# Altium schematic sheet posture_corrector_schematic.SchDoc
size A4; SheetNumber: 1; SheetTotal: 1
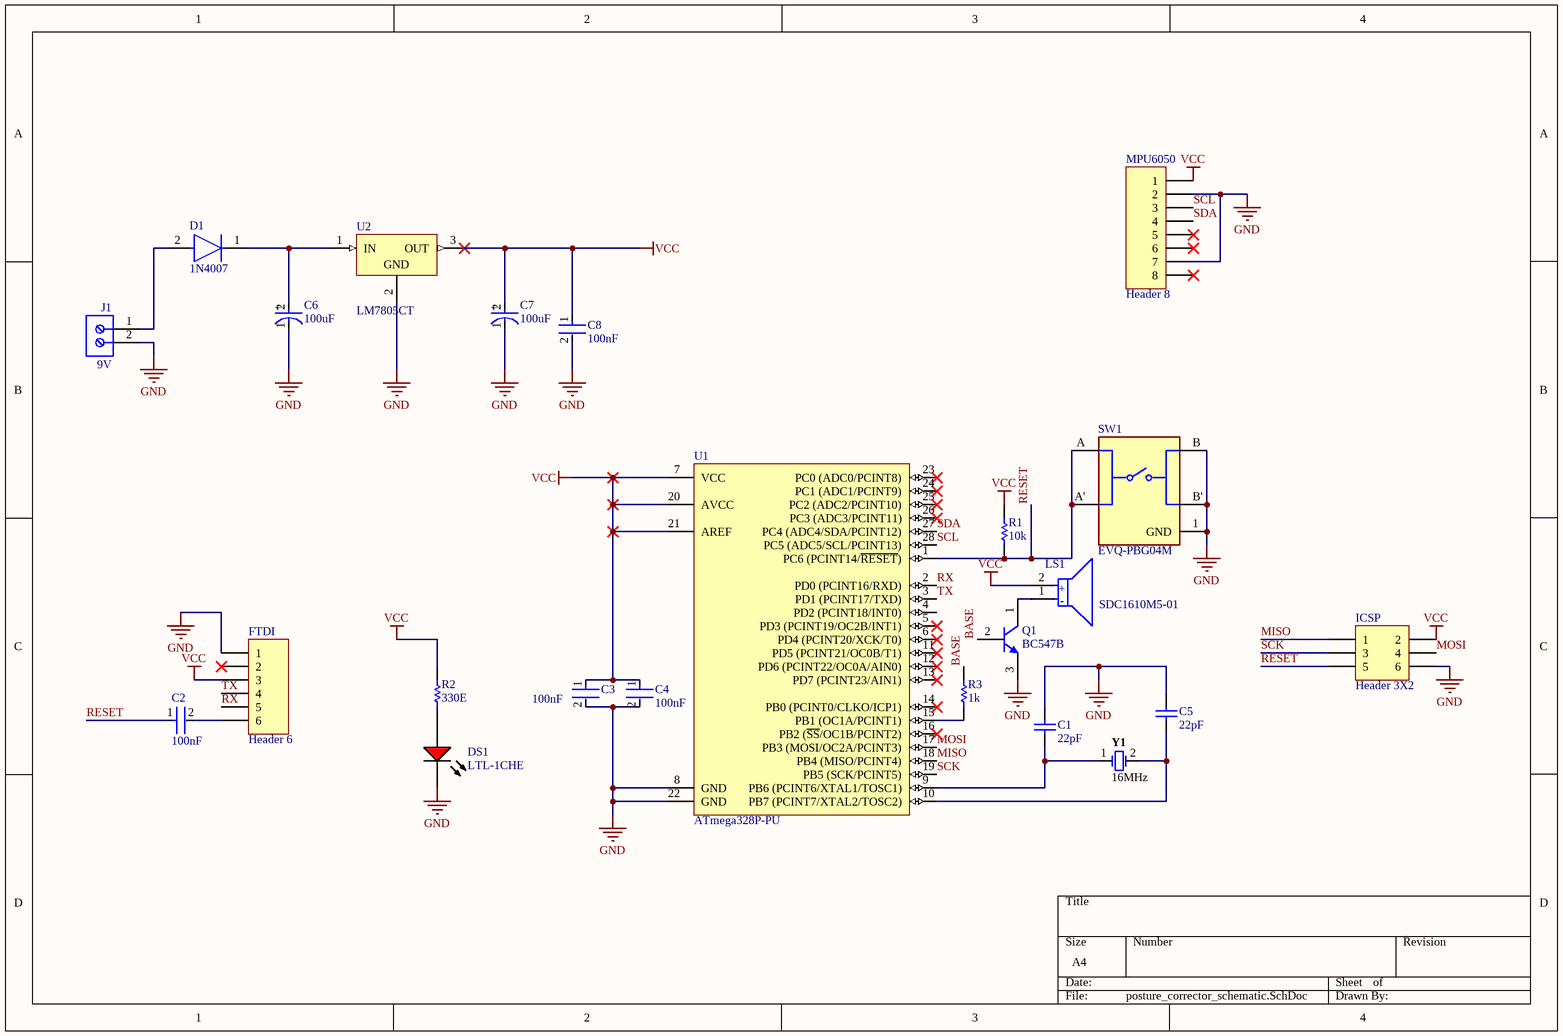
[diagram p0: posture_corrector_schematic.SchDoc]

## Parts
C1  22pF  [KEMT-C315-THT-2]
C2  100nF  [FP-RCE1A2-MFG]
C3  100nF  [FP-RCE1K1-2_5-MFG]
C4  100nF  [FP-RCE1K1-2_5-MFG]
C5  22pF  [KEMT-C315-THT-2]
C6  100uF  [FP-RAD-TH-D_6_3_0_5-L_11-MFG]
C7  100uF  [FP-RAD-TH-D_6_3_0_5-L_11-MFG]
C8  100nF  [FP-RCE1K1-2_5-MFG]
D1  1N4007  [FP-1N4007E-E3-54-MFG]
DS1  LTL-1CHE  [INDPR60-254-520X380X650]
FTDI  Header 6  [HDR1X6]
ICSP  Header 3X2  [HDR2X3]
J1  9V  [691211720002]
LS1  SDC1610M5-01  [FP-SDC1610M5-01-MFG]
MPU6050  Header 8  [HDR1X8]
Q1  BC547B  [ONSC-TO-92-3-29-11]
R1  value 10k  [AXIAL-0.3]
R2  value 330E  [AXIAL-0.3]
R3  value 1k  [AXIAL-0.3]
SW1  EVQ-PBG04M  [FP-EVQ-PBG04M-MFG]
U1  ATmega328P-PU  [28P3]
U2  LM7805CT  [FAIR-TO-220-3]
Y1  16MHz  [FOX-FOXSLF160-20]

## Nets
GND: C1.2 C3.2 C4.2 C5.2 C6.1(C) C7.1(C) C8.2 DS1.2(K) FTDI.1 ICSP.6 J1.2 MPU6050.2 MPU6050.7 Q1.3(E) SW1.1(GND) SW1.B SW1.B' U1.8(GND) U1.22(GND) U2.2(GND)
VCC: C3.1 C4.1 C7.2(A) C8.1 FTDI.3 ICSP.2 LS1.2(A) MPU6050.1 R1.2 R2.2 U1.7(VCC) U1.20(AVCC) U1.21(AREF) U2.3(OUT)
BASE: Q1.2(B) R3.2
MISO: ICSP.1 U1.18(PB4_(MISO/PCINT4))
MOSI: ICSP.4 U1.17(PB3_(MOSI/OC2A/PCINT3))
RESET: C2.1 ICSP.5 R1.1 SW1.A SW1.A' U1.1(PC6_(PCINT14/~{RESET}))
RX: FTDI.5 U1.2(PD0_(PCINT16/RXD))
SCK: ICSP.3 U1.19(PB5_(SCK/PCINT5))
SCL: MPU6050.3 U1.28(PC5_(ADC5/SCL/PCINT13))
SDA: MPU6050.4 U1.27(PC4_(ADC4/SDA/PCINT12))
TX: FTDI.4 U1.3(PD1_(PCINT17/TXD))
NetC1_1: C1.1 U1.9(PB6_(PCINT6/XTAL1/TOSC1)) Y1.1
NetC2_2: C2.2 FTDI.6
NetC5_1: C5.1 U1.10(PB7_(PCINT7/XTAL2/TOSC2)) Y1.2
NetC6_2: C6.2(A) D1.1(C) U2.1(IN)
NetD1_2: D1.2(A) J1.1
NetDS1_1: DS1.1(A) R2.1
NetLS1_1: LS1.1(C) Q1.1(C)
NetR3_1: R3.1 U1.15(PB1_(OC1A/PCINT1))

Not connected (* = marked no-connect by the designer): FTDI 2*; MPU6050 5* 6* 8*; U1 4(PD2_(PCINT18/INT0)) 5(PD3_(PCINT19/OC2B/INT1))* 6(PD4_(PCINT20/XCK/T0))* 11(PD5_(PCINT21/OC0B/T1))* 12(PD6_(PCINT22/OC0A/AIN0))* 13(PD7_(PCINT23/AIN1))* 14(PB0_(PCINT0/CLKO/ICP1))* 16(PB2_(~{SS}/OC1B/PCINT2))* 23(PC0_(ADC0/PCINT8))* 24(PC1_(ADC1/PCINT9))* 25(PC2_(ADC2/PCINT10))* 26(PC3_(ADC3/PCINT11))*

## Notes on the sheet
- (in symbol CMP-05427-000779-1) +
- (in symbol CMP-08413-000008-1) +; -

## Library data of the parts
C1 C5 = CMP-1664-00008-1: Capacitor, Ceramic, 22 pF, +/-10 %, 100 V, -55 to 125 degC, 2-Pin THD, RoHS, Bulk; Max Input Voltage: 40 V; Min Input Voltage: 4.2 V; Output Current: 1.5 A; Output Voltage: 1.2 V; Outputs: 1; Case\Package: TO-220; RoHSCompliant: true; Min Operating Temperature: 0 degC; Max Operating Temperature: 125 degC; Package Quantity: 50; ComponentLink2URL: http://capacitoredge.kemet.com/capedge2/DataSheet/Datasheet-C315C220K1G5TA.pdf?pn=C315C220K1G5TA{BULK}; Radiation Hardening: No; Pins: 3; Length: 10.28 mm; ComponentLink1URL: http://www.kemet.com/; ComponentLink2Description: Datasheet; Height: 9.28 mm; REACH SVHC: No SVHC; ComponentLink1Description: Manufacturer URL; Max Ouput Current: 1.5 A; Weight: 0.08113 oz; Packaging: Rail/Tube; DatasheetVersion: Aug-16; Mount: Through Hole; PackageReference: C315-THT-2; Width: 4.82 mm; PackageDescription: 2-Pin Through Hole Device, Body 3.81 x 2.54 mm
C2 = CMP-06035-052488-1: Cap Ceramic 100nF 100V X7R ±10% Radial 2.5mm +125°C Automotive Ammo Pack; Lead/Base Style: Straight; Lead Diameter: 0.5mm; Termination: Radial; Height: 3.5mm; Capacitance: 100nF; Ratings: AEC-Q200; Max Operating Temperature: 125°C; Min Operating Temperature: -55°C; Case/Package: Radial; Package Quantity: 2000; Resistor Type: Ceramic; Mount: Through Hole; Dielectric: X7R; Lead Free: Lead Free; Height - Seated (Max): 0.138inch; Width: 0.098inch; Tolerance: 10%; Packaging: Tape and Reel; Lead Pitch: 0.098inch; Length: 0.157inch; Voltage Rating: 100V; Voltage Rating (DC): 100V
C3 C4 C8 = CMP-06035-011084-1: Cap Ceramic Monolithic 100nF 100V 10% Thru-Hole Bulk; Dielectric: X7R; Lead/Base Style: Formed Leads; Lead Diameter: 0.5mm; Resistor Type: Ceramic; Voltage Rating: 100V; Case/Package: Radial; Packaging: Bulk; Capacitance: 100nF; Lead Pitch: 0.197inch; Height - Seated (Max): 0.138inch; Voltage Rating (DC): 100V; Mount: Through Hole; Height: 3.5mm; Width: 0.098inch; Termination: Radial; Tolerance: 10%; Min Operating Temperature: -55°C; Package Quantity: 500; Max Operating Temperature: 125°C; Length: 0.157inch; Ratings: AEC-Q200
C6 C7 = CMP-05427-000779-1: Aluminum Electrolytic Capacitors (Radial Lead Type) 2.2uF ±20% 250V; Lead Diameter: 0.5mm; Lead/Base Style: Straight; Ripple Current: 29mA; Life (Hours): 2000Hour; Package Quantity: 2000; Height: 11.2mm; Tolerance: 20%; Mount: Through Hole; Length: 11.2mm; Height - Seated (Max): 0.48inch; Voltage Rating: 250V; Capacitance: 2.2uF; Max Operating Temperature: 105°C; Voltage Rating (DC): 250V; Diameter: 6.3mm; Packaging: Ammo Pack; Radiation Hardening: No; Case/Package: Radial; Termination: Radial; Min Operating Temperature: -25°C; Lead Pitch: 2.5mm; Series: NHG
D1 = CMP-02540-000087-1: DIODE GEN PURP 1KV 1A DO204AL; Peak Non-Repetitive Surge Current: 45A; Forward Voltage: 1.1V; Element Configuration: Single; Max Reverse Current: 5uA; Max Repetitive Reverse Voltage (Vrrm): 1kV; RoHS Compliant: Yes; Max Surge Current: 45A; Min Operating Temperature: -50°C; Radiation Hardening: No; Average Rectified Current: 1A; Series: -; Packaging: Tape and Reel; Contact Plating: Tin; Package Quantity: 5500; Max Reverse Voltage (DC): 1kV; Reverse Voltage: 1kV; Number of Pins: 2; Max Operating Temperature: 150°C; Case/Package: DO-41; Mount: Through Hole
DS1 = CMP-1674-00005-1: Radial LED, 12.6 mcd, 20 mA, 2 V, -55 to 100 degC, 2-Pin THD, RoHS, Bulk; Shielding: Unshielded; Resistance: 0.045 Ohm; Current Rating: 3.6 A; Tolerance: 20%; PackageReference: LTL-1CHE; PackageDescription: 2-Pin Through Hole Device, Dia 3.8 mm, Pitch 2.54 mm; Case\Package: Radial; Length: 0.97 inch; Width: 0.62 inch; Height: 1.1 inch; Radiation Hardening: No; Lead Pitch: 11.44 mm; ComponentLink1URL: http://www.us.liteon.com/; ComponentLink1Description: Manufacturer URL; RoHSCompliant: true; Packaging: Tray; Mount: Through Hole; Min Operating Temperature: -40 degC; Max Operating Temperature: 130 degC; ComponentLink2URL: https://datasheet.ciiva.com/15117/getdatasheetpartid-187746-15117985.pdf; Package Quantity: 55; ComponentLink2Description: Datasheet; DatasheetVersion: Dec-03
FTDI = Header 6: Header, 6-Pin; LatestRevisionDate: 17-Jul-2002; LatestRevisionNote: Re-released for DXP Platform.; Publisher: Altium Limited
ICSP = Header 3X2: Header, 3-Pin, Dual row; LatestRevisionDate: 17-Jul-2002; LatestRevisionNote: Re-released for DXP Platform.; Publisher: Altium Limited
J1 = CMP-1502-02524-3: 211 Series 5MM Pitch Straight, Pcb Terminal Block, Through Hole, 2 Way; Number of Levels: 1; Current: 10A; Voltage: 300V; Pitch: 5.0038mm; Wire Gauge (Min): 12AWG; Connector Type: PCB, Terminal Block; Number of Positions Per Level: 2; Plating: Brass, Steel; Wire Gauge (Max): 24AWG; Stripping Length: -7mm; Termination: Screw; Height: 15.5mm; Contact Plating: Tin; REACH SVHC: Unknown; Contact Material: Brass; Width: 10mm; RoHS: Compliant; Number of Pins: 2; Lead Pitch: 5mm; Mount: Through Hole; Min Operating Temperature: -40°C; Length: 13.7mm; Number of Contacts: 2; Color: Green; Wire/Cable Gauge: 12AWG; Housing Material: Nylon; Packaging: Box; Max Operating Temperature: 105°C
LS1 = CMP-08413-000008-1: AUDIO MAGNETIC INDICATOR 4-8V TH; Nominal Supply Voltage (DC): 5V; Input Type: DC; Max Supply Current: 30mA; Number of Terminals/Pins: 2; Frequency: 2.4kHz; Lead Free: Lead Free; Operating Supply Current: 30mA; Sensing Method: Magnetic; Termination: PC Pins; Number of Pins: 2; Mount: Through Hole; Min Operating Temperature: -10°C; Diameter: 16mm; Series: SDC; Max Operating Temperature: 70°C; Packaging: Tray; Voltage Rating: 5V; Height: 10mm
MPU6050 = Header 8: Header, 8-Pin; LatestRevisionDate: 17-Jul-2002; LatestRevisionNote: Re-released for DXP Platform.; Publisher: Altium Limited
Q1 = CMP-1048-01467-1: Amplifier Transistor, NPN Silicon, 3-Pin TO-92, Bulk Box; Manufacturer: On Semiconductor; IC Continuous (A): 0.1; fT Min (MHz): 150; DatasheetVersion: Rev. 7; ComponentLink1URL: http://www.onsemi.com/; Polarity: NPN; RoHS: FALSE; ComponentLink1Description: Manufacturer URL; Packing: Bulk Box; PackageDescription: 3-Pin Transistor Outline, Body 4.825 x 3.685 mm, Pitch 1.27 mm; ComponentLink3URL: http://www.onsemi.cn/pub_link/Collateral/2N6426-D.PDF; ComponentLink2Description: Datasheet; PackageVersion: Rev. AM; PackageReference: TO-92-3-29-11_AM_SL; ComponentLink3Description: Package Specification; Mounting Technology: Through Hole; PartNumber: BC547B; ComponentLink2URL: http://www.onsemi.com/pub_link/Collateral/BC546-D.PDF
R1-R3 = Res1: Resistor; Published: 8-Jun-2000; LatestRevisionDate: 17-Jul-2002; LatestRevisionNote: Re-released for DXP Platform.; PackageReference: AXIAL-0.3; Publisher: Altium Limited; PackageDescription: Axial Device, Thru-Hole; 2 Leads; 0.3 in Pin Spacing
SW1 = CMP-05618-000021-1: SWITCH TACTILE SPST-NO 0.02A 15V; Actuator Length: 0.4mm; Actuator Type: Standard; Actuator Color: White; Current Rating: 20mA; Electrical Life: 50000Cycles; Switch Travel: 0.25mm; Contact Resistance: 50mR; Operating Force: 2.6N; Illumination Type: Non-Illuminated; Throw Configuration: SPST; Switch Function: Off-Mom; Size: 6mm; Lead Free: Lead Free; Series: EVQPB; Radiation Hardening: No; Package Quantity: 500; Max Operating Temperature: 70°C; Contact Current Rating: 20mA; Max Voltage Rating (DC): 15V; Packaging: Bulk; RoHS Compliant: Yes; Mount: Through Hole; Termination: PC Pin; Orientation: Straight; Voltage Rating (DC): 15V; Min Operating Temperature: -20°C; Mechanical Life: 50000Cycles
U1 = CMP-0095-00013-2: 8-bit AVR Microcontroller, 32KB Flash, 1KB EEPROM, 2KB SRAM, 28-pin PDIP, Industrial Grade (-40°C to 85°C); RevisionNote: DatasheetVersion updated. URLs added.; PackageVersion: revB, Sep-2001; PackageDescription: 28-lead (0.300"/7.62mm Wide) Plastic Dual Inline Package (PDIP); DatasheetVersion: revD, May-2011; ComponentLink1Description: Manufacturer URL; ComponentLink1URL: http://www.atmel.com/; PackageReference: 28P3; ComponentLink2Description: ATmega48A/48PA/88A/88PA/168A/168PA/328/328P Datasheet; ComponentLink3URL: http://www.atmel.com/dyn/resources/prod_documents/8271S.pdf; ComponentLink2URL: http://www.atmel.com/dyn/resources/prod_documents/8271.pdf; ComponentLink3Description: ATmega48A/48PA/88A/88PA/168A/168PA/328/328P Summary
U2 = CMP-2000-04938-1: Positive Voltage Regulator, 5 V, 1 A, -40 to 125 degC, 3-Pin TO-220, RoHS, Tube; Manufacturer: FairchildSemiconductor; Maximum Input Voltage: 35V; Maximum Quiescent Current: 8mA; Load Regulation: 100mV; Maximum Output Current: 2.2(Typ)A; Output Type: Fixed; Typical Dropout Voltage @ Current: 2@1AV; Rad Hard: No; Output Voltage: 5V; Accuracy: ±4%; Number of Outputs: 1; Category: LinearRegulator; Package Description: 3-Pin Through Hole Device, Body 10 x 4.5 mm, Pitch 2.54 mm; Packaging: Rail/Tube; Mounting: ThroughHole; Polarity: Positive; Manufacturer URL: https://www.fairchildsemi.com/; Line Regulation: 100mV; Datasheet Version: Aug-12; Datasheet URL: https://datasheet.ciiva.com/26904/lm7805ct-26904988.pdf; Package Reference: TO-220; Package URL: https://www.fairchildsemi.com/package-drawings/TO/TO220B03.pdf; Package: 3TO-220AB; Operating Temperature: -40to125degC; Type: Linear
Y1 = CMP-1749-00003-1: Resistance Weld Thru-Hole Crystal, 16 MHz, -20 to 70 degC, 2-Pin THD, RoHS, Bulk; Voltage Rating: 250 V; Tolerance: 1%; Resistance: 221 kohm; Case\Package: Axial; Power Rating: 250 mW; RoHSCompliant: true; Package Quantity: 200; Packaging: Bulk; Min Operating Temperature: -55 degC; DatasheetVersion: Mar-15; ComponentLink1URL: http://www.foxonline.com/; Max Operating Temperature: 155 degC; PackageReference: FOXSLF160-20; Mount: Through Hole; PackageDescription: 2-Pin Through Hole Device, Body 11.35 x 4.65 mm; ComponentLink1Description: Manufacturer URL; ComponentLink2URL: http://www.foxonline.com/pdfs/hc49slf.pdf; ComponentLink2Description: Datasheet; Length: 0.248 inch